# Altium schematic sheet Input channel.SchDoc: Board Level Annotation
size 431 x 279 mm; Organization: Altium Limited; Address1: L3, 12a Rodborough Rd; Address2: Frenchs Forest; Address3: NSW; Address4: Australia 2086; DocumentNumber: 4; SheetNumber: 4; SheetTotal: 8
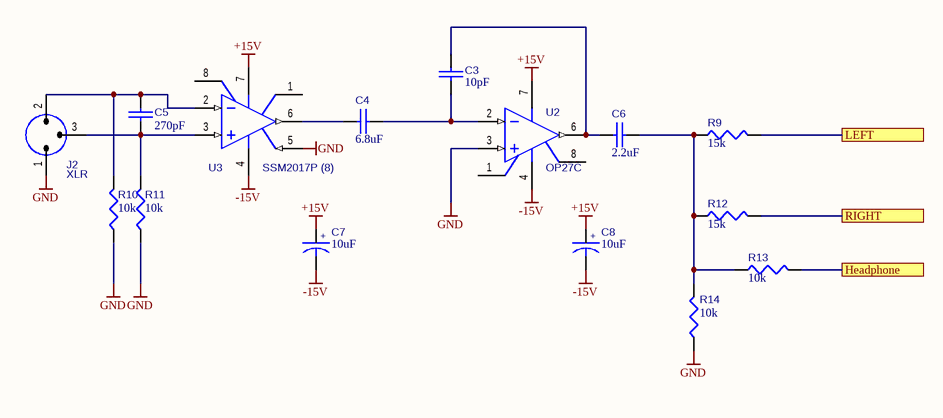
[diagram p0: Input channel.SchDoc]

## Parts
C3  10pF  [RAD0.2]
C4  6.8uF  [RB.2/.4-NP]
C5  270pF  [RAD0.2]
C6  2.2uF  [RB.2/.4-NP]
C7  10uF  [RB.2/.4]
C8  10uF  [RB.2/.4]
J2  XLR  [XLR-FEMALE]
R9  15k  [AXIAL0.4]
R10  10k  [AXIAL0.4]
R11  10k  [AXIAL0.4]
R12  15k  [AXIAL0.4]
R13  10k  [AXIAL0.4]
R14  10k  [AXIAL0.4]
U2  OP27C  [DIP8]
U3  SSM2017P (8)  [DIP8]

## Ports
Headphone, LEFT, RIGHT

## Nets
+15V: C7.1 C8.1 U2.7(V+) U3.7(V+)
-15V: C7.2 C8.2 U2.4(V-) U3.4(V-)
GND: J2.1 R10.1 R11.1 R14.1 U2.3(+IN) U3.5(REF)
Headphone: R13.2 ; port Headphone
LEFT: R9.2 ; port LEFT
RIGHT: R12.2 ; port RIGHT
NetC3_1: C3.1 C4.2 U2.2(-IN)
NetC3_2: C3.2 C6.1 U2.6(OUT)
NetC4_1: C4.1 U3.6(OUT)
NetC5_1: C5.1 J2.2 R10.2 U3.2(IN-)
NetC5_2: C5.2 J2.3 R11.2 U3.3(IN+)
NetC6_2: C6.2 R9.1 R12.1 R13.1 R14.2

Not connected (* = marked no-connect by the designer): U2 1(TRIM) 8(TRIM); U3 1(RG1) 8(RG2)

## Notes on the sheet
- 8
- 7
- 6
- 5
- 4
- 3
- DWG. NO.
- REV.
- SHT.
- 2
- 1
- THIS DOCUMENT AND THE DATA DISCLOSED HEREIN OR HEREWITH IS THE PROPERTY OF ALTIUM LIMITED AND MAY BE FREELY DISTRIBUTED IN WHOLE. NO RIGHTS ARE RESERVED OR EXPRESS OR IMPLIED WARANTEE GIVEN.
- REVISION
- DESCRIPTION
- DATE
- APPROVED
- F
- E
- D
- C
- B
- A
- TITLE
- SCALE:
- SIZE
- CAGE CODE
- FILE NAME
- DWG NO.
- SHEET
- OF
- REV
- (in symbol CAPACITOR POL) +

## Library data of the parts
C3-C6 = CAP: Capacitor
C7 C8 = CAPACITOR POL: Bi-Polar Capacitor; Value: 10uF
J2 = XLR: XLR connector, PCB mounted
R9-R14 = RES1: Resistor
  R9 R12: Value: 15k
  R10 R11 R13 R14: Value: 10k
U2 = OP27C: Low Noise, High Speed Precision Operational Amplifier
U3 = SSM2017P (8): Self-Contained Audio Preamplifier